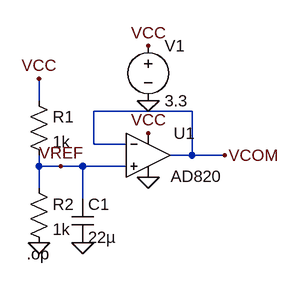
[diagram p0: schematic DC-OperatingPointAlalysis.asc]
DC-OperatingPointAlalysis.asc, the LTspice schematic file:
Version 4
SHEET 1 880 680
WIRE 32 96 32 64
WIRE 256 112 112 112
WIRE 112 160 112 112
WIRE 160 160 112 160
WIRE 256 176 256 112
WIRE 256 176 224 176
WIRE 304 176 256 176
WIRE 32 192 32 176
WIRE 64 192 32 192
WIRE 96 192 64 192
WIRE 160 192 96 192
WIRE 32 224 32 192
WIRE 96 240 96 192
FLAG 192 16 VCC
FLAG 192 144 VCC
FLAG 192 96 0
FLAG 192 208 0
FLAG 32 64 VCC
FLAG 32 304 0
FLAG 96 304 0
FLAG 64 192 VREF
FLAG 304 176 VCOM
SYMBOL OpAmps\\AD820 192 112 R0
WINDOW 0 37 32 Left 2
WINDOW 3 33 95 Left 2
SYMATTR InstName U1
SYMBOL voltage 192 0 R0
WINDOW 123 0 0 Left 0
WINDOW 39 0 0 Left 0
SYMATTR InstName V1
SYMATTR Value 3.3
SYMBOL res 16 80 R0
SYMATTR InstName R1
SYMATTR Value 1k
SYMBOL res 16 208 R0
SYMATTR InstName R2
SYMATTR Value 1k
SYMBOL cap 80 240 R0
SYMATTR InstName C1
SYMATTR Value 22µ
TEXT 14 320 Left 2 !.op

The netlist it stands for:
* DC-OperatingPointAlalysis.asc
XU1 VREF VCOM VCC 0 VCOM AD820  ; pins In+ In- V+ V- OUT
V1 VCC 0 3.3
R1 VCC VREF 1k
R2 VREF 0 1k
C1 VREF 0 22µ
.op
.backanno
.end

* Results of the author's LTspice run, read from the files saved beside the schematic
* Operating Point:
*   V(vcc) = 3.3 V
*   V(vcom) = 1.65 V
*   V(vref) = 1.65 V
*   I(C1) = 0 A
*   I(R1) = 1.65 mA
*   I(R2) = 1.65 mA
*   I(V1) = -1.999 mA
*   Ix(u1:1) = 2 pA
*   Ix(u1:2) = 2 pA
*   Ix(u1:3) = 349.3 µA
*   Ix(u1:4) = -349.3 µA
*   Ix(u1:5) = -2 pA
* From the log:
*   Semiconductor Device Operating Points:
*                           --- Diodes ---
*   Name:    d:u1:21     d:u1:22     d:u1:5      d:u1:6      d:u1:1
*   Model:   u1:esd      u1:esd       u1:x1       u1:x2       u1:iq
*   Id:     -1.65e-12   -1.65e-12   -8.25e-07   -8.25e-07    3.48e-04
*   Vd:     -1.65e+00   -1.65e+00   -1.65e+00   -1.65e+00    3.30e+00
*   Req:     1.00e-12    1.00e-12    5.00e-07    5.00e-07    5.00e-04
*   CAP:     0.00e+00    0.00e+00    0.00e+00    0.00e+00    0.00e+00
*   Name:    d:u1:2      d:u1:3
*   Model:  u1:20ohm     u1:45ma
*   Id:      2.00e-12   -2.00e-12
*   Vd:      6.00e-11   -2.00e-11
*   Req:     1.00e-01    1.00e-01
*   CAP:     0.00e+00    0.00e+00